# EAGLE design zamekKodowy_odbiornik (EAGLE 6.3)
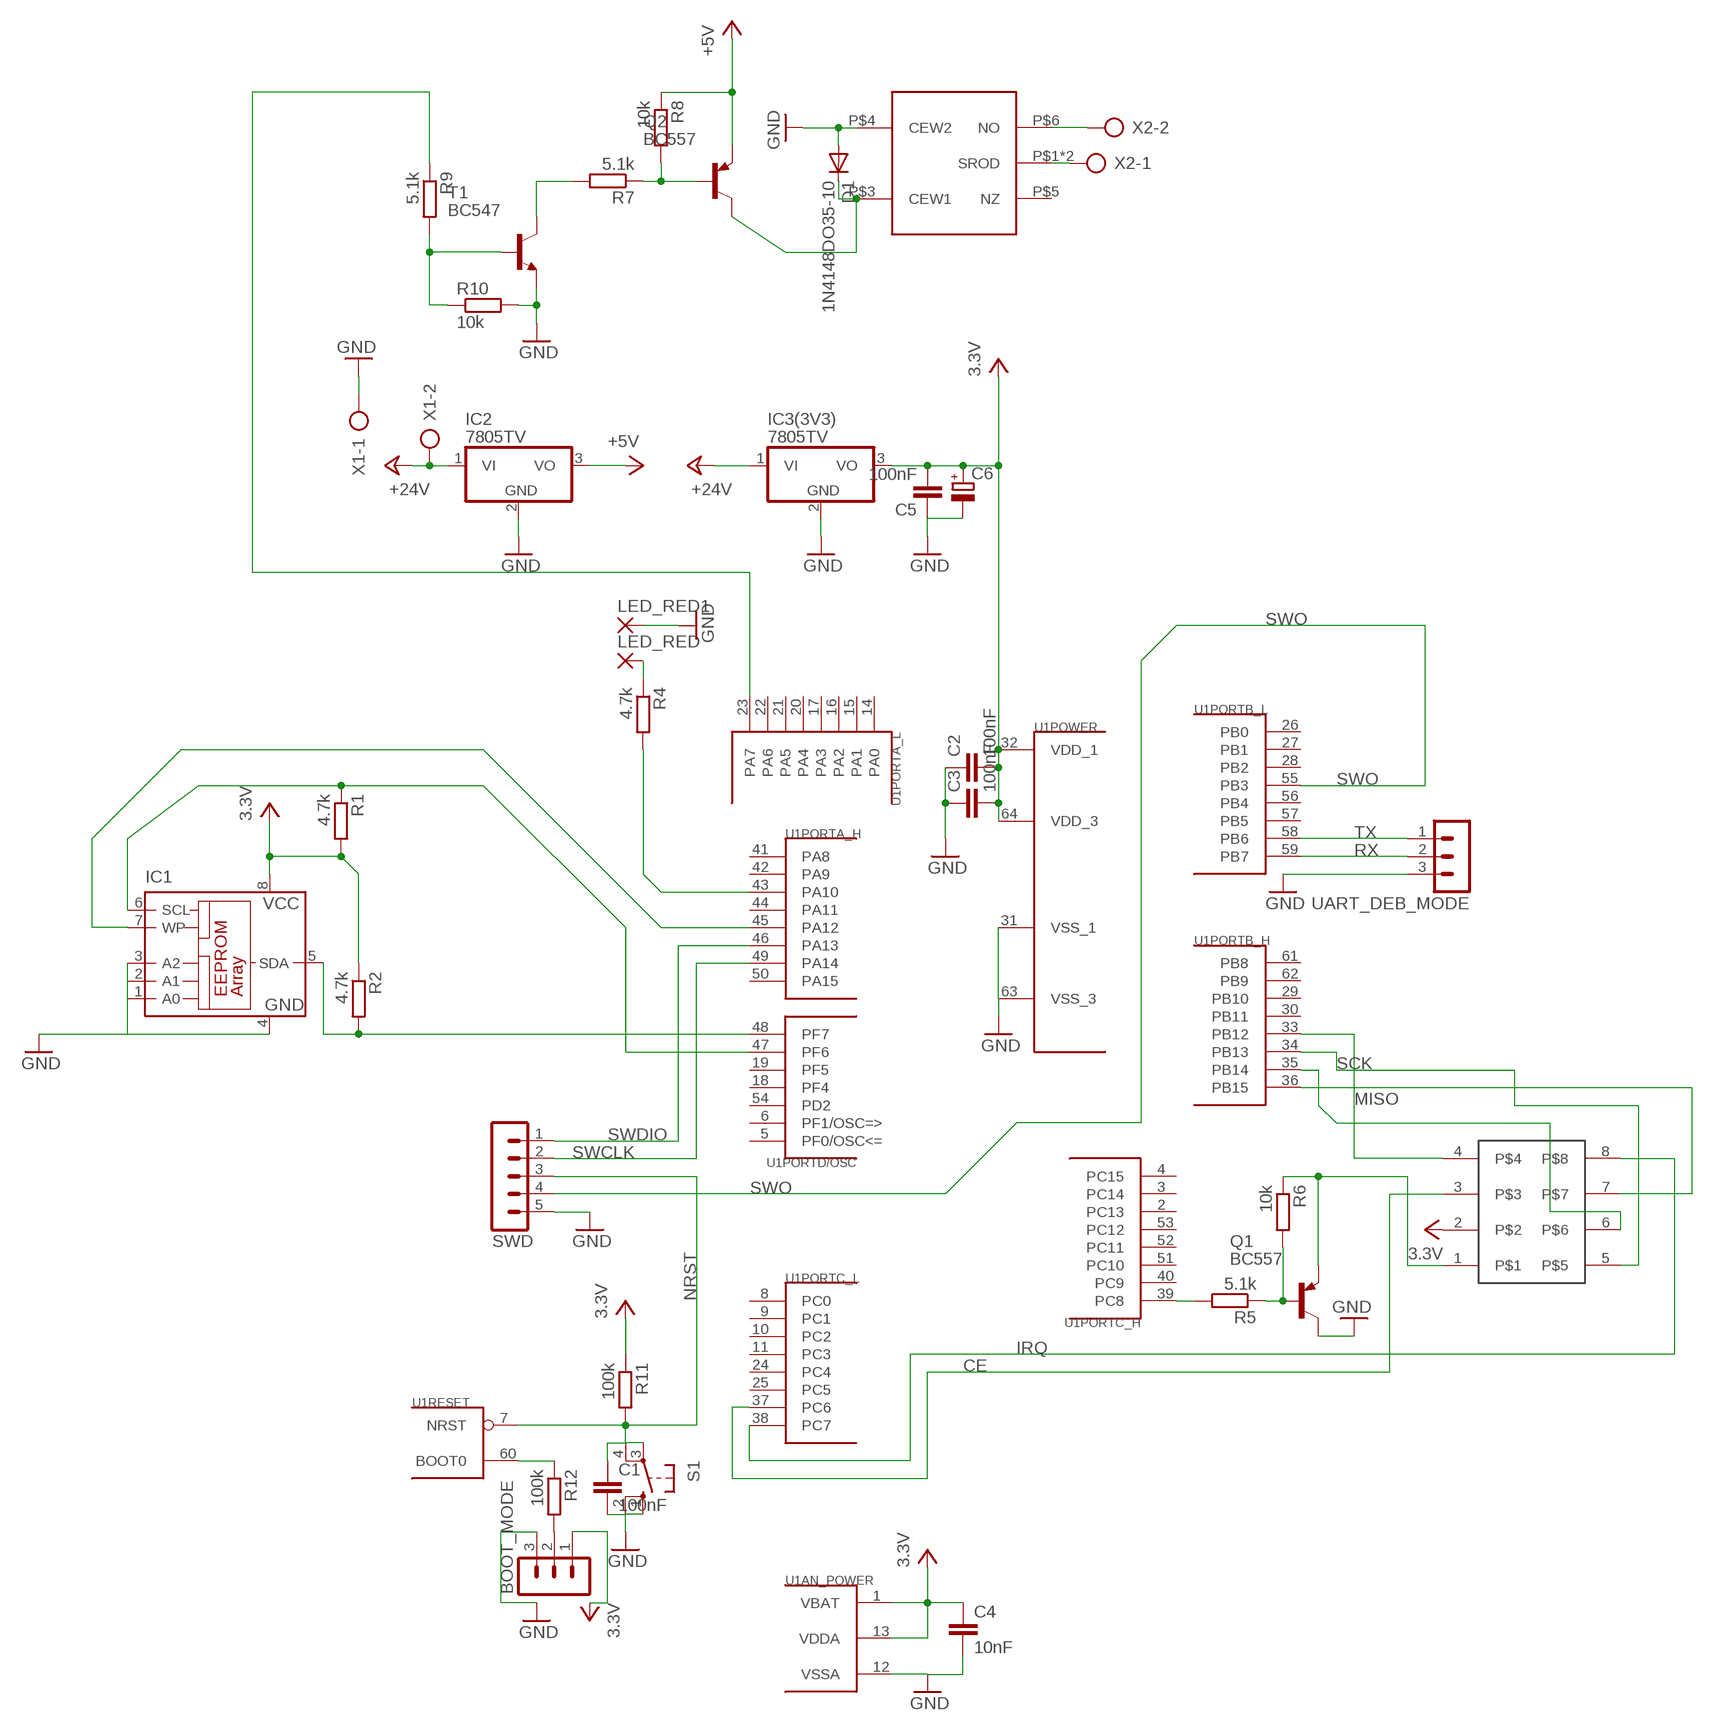
[diagram p0: schematic, sheet 1]

## Parts
BOOT_MODE  MA03-1  [MA03-1]
C1  100nF  C-EUC0603  [C0603]
C2  100nF  C-EUC0603  [C0603]
C3  100nF  C-EUC0603  [C0603]
C4  10nF  C-EUC0603  [C0603]
C5  100nF  C-EUC0603  [C0603]
C6  CPOL-EUE2-5  [E2-5]
CON1  CON10  [CON10]
D1  1N4148DO35-10  [DO35-10]
IC1  24C16BSN  [SO-08]
IC2  7805TV  [TO220V]
IC3(3V3)  7805TV  [TO220V]
LED_RED  2,54/0,9  [2,54/0,9]
LED_RED1  2,54/0,9  [2,54/0,9]
Q1  BC557  [TO92]
Q2  BC557  [TO92]
R1  4.7k  R-EU_R0603  [R0603]
R2  4.7k  R-EU_R0603  [R0603]
R4  4.7k  R-EU_R0603  [R0603]
R5  5.1k  R-EU_R0603  [R0603]
R6  10k  R-EU_R0603  [R0603]
R7  5.1k  R-EU_R0603  [R0603]
R8  10k  R-EU_R0603  [R0603]
R9  5.1k  R-EU_R0603  [R0603]
R10  10k  R-EU_R0603  [R0603]
R11  100k  R-EU_R0603  [R0603]
R12  100k  R-EU_R0603  [R0603]
S1  10-XX  [B3F-10XX]
SWD  MA05-1  [MA05-1]
T1  BC547  [TO92]
U1  STM32F10XRXT6  [TQFP64]
U$1  PRZEKAZ  [FPR]
UART_DEB_MODE  MA03-1  [MA03-1]
X1  AK300/2  [AK300/2]
X2  AK300/2  [AK300/2]

## Nets
+5V: IC2.3(VO) Q2.1(E) R8.1
+24V: IC2.1(VI) IC3(3V3).1(VI) X1.2
CE: CON1.3 U1.37(PORTC_L:PC6)
GND: BOOT_MODE.3 C1.2 C2.1 C3.1 C4.2 C5.1 C6.- D1.A IC1.1(A0) IC1.2(A1) IC1.3(A2) IC1.4(GND) IC2.2(GND) IC3(3V3).2(GND) LED_RED1.1(P) Q1.3(C) R10.2 S1.1(S) S1.2(S1) SWD.5 T1.1(E) U1.12(AN_POWER:VSSA) U1.31(POWER:VSS_1) U1.63(POWER:VSS_3) U$1.P$4(CEW2) UART_DEB_MODE.3 X1.1
IRQ: CON1.8 U1.38(PORTC_L:PC7)
MISO: CON1.7 U1.36(PORTB_H:PB15)
MOSI: CON1.6 U1.35(PORTB_H:PB14)
N$1: IC1.5(SDA) R2.2 U1.48(PORTD/OSC:PF7)
N$2: IC1.6(SCL) R1.1 U1.47(PORTD/OSC:PF6)
N$3: IC1.7(WP) U1.45(PORTA_H:PA12)
N$4: R9.1 U1.23(PORTA_L:PA7)
N$5: R4.2 U1.43(PORTA_H:PA10)
N$7: LED_RED.1(P) R4.1
N$8: Q1.2(B) R5.1 R6.2
N$9: U$1.P$1(SROD) U$1.P$2(SROD) X2.1
N$10: R5.2 U1.39(PORTC_H:PC8)
N$11: CON1.1 Q1.1(E) R6.1
N$12: U$1.P$6(NO) X2.2
N$13: D1.C Q2.3(C) U$1.P$3(CEW1)
N$14: Q2.2(B) R7.1 R8.2
N$16: R7.2 T1.3(C)
N$17: R9.2 R10.1 T1.2(B)
N$19: R12.1 U1.60(RESET:BOOT0)
N$20: BOOT_MODE.2 R12.2
NRST: C1.1 R11.2 S1.3(P) S1.4(P1) SWD.3 U1.7(RESET:NRST)
NSS: CON1.4 U1.33(PORTB_H:PB12)
RX: U1.59(PORTB_L:PB7) UART_DEB_MODE.2
SCK: CON1.5 U1.34(PORTB_H:PB13)
SWCLK: SWD.2 U1.49(PORTA_H:PA14)
SWDIO: SWD.1 U1.46(PORTA_H:PA13)
SWO: SWD.4 U1.55(PORTB_L:PB3)
TX: U1.58(PORTB_L:PB6) UART_DEB_MODE.1
VCC: BOOT_MODE.1 C2.2 C3.2 C4.1 C5.2 C6.+ CON1.2 IC1.8(VCC) IC3(3V3).3(VO) R1.2 R2.1 R11.1 U1.1(AN_POWER:VBAT) U1.13(AN_POWER:VDDA) U1.32(POWER:VDD_1) U1.64(POWER:VDD_3) ; supply symbol labelled 3.3V
Unconnected: U1.2(PORTC_H:PC13) U1.3(PORTC_H:PC14) U1.4(PORTC_H:PC15) U1.5(PORTD/OSC:PF0/OSC<=) U1.6(PORTD/OSC:PF1/OSC=>) U1.8(PORTC_L:PC0) U1.9(PORTC_L:PC1) U1.10(PORTC_L:PC2) U1.11(PORTC_L:PC3) U1.14(PORTA_L:PA0) U1.15(PORTA_L:PA1) U1.16(PORTA_L:PA2) U1.17(PORTA_L:PA3) U1.18(PORTD/OSC:PF4) U1.19(PORTD/OSC:PF5) U1.20(PORTA_L:PA4) U1.21(PORTA_L:PA5) U1.22(PORTA_L:PA6) U1.24(PORTC_L:PC4) U1.25(PORTC_L:PC5) U1.26(PORTB_L:PB0) U1.27(PORTB_L:PB1) U1.28(PORTB_L:PB2) U1.29(PORTB_H:PB10) U1.30(PORTB_H:PB11) U1.40(PORTC_H:PC9) U1.41(PORTA_H:PA8) U1.42(PORTA_H:PA9) U1.44(PORTA_H:PA11) U1.50(PORTA_H:PA15) U1.51(PORTC_H:PC10) U1.52(PORTC_H:PC11) U1.53(PORTC_H:PC12) U1.54(PORTD/OSC:PD2) U1.56(PORTB_L:PB4) U1.57(PORTB_L:PB5) U1.61(PORTB_H:PB8) U1.62(PORTB_H:PB9) U$1.P$5(NZ)

## Library data of the parts
BOOT_MODE UART_DEB_MODE = con-lstb:MA03-1: PIN HEADER; OC_FARNELL: unknown; OC_NEWARK: unknown
C1-C5 = resistor:C-EU: CAPACITOR, European symbol
C6 = resistor:CPOL-EU: POLARIZED CAPACITOR, European symbol
CON1 = con-harting:CON10: CONNECTOR; OC_FARNELL: unknown; OC_NEWARK: unknown
D1 = diode:1N4148: DIODE high speed (Philips)
IC1 = microchip:24*: Serial EEPROM I2C; MPN: AT24C16BN-SH-B; OC_FARNELL: 1362651; OC_NEWARK: 50M3324
IC2 IC3(3V3) = linear:78*: Positive VOLTAGE REGULATOR Source: http://cache.national.com/ds/LM/LM78L05.pdf http://www.fairchildsemi.com/ds/LM/LM7805.pdf
LED_RED LED_RED1 = wirepad:2,54/0,9: THROUGH-HOLE PAD
Q1 Q2 = transistor-pnp:BC557: PNP Transistor
R1 R2 R4-R12 = rcl:R-EU_: RESISTOR, European symbol
S1 = switch-omron:10-XX: OMRON SWITCH; MPN: B3F-1000; OC_FARNELL: 176432; OC_NEWARK: 36M3542
SWD = con-lstb:MA05-1: PIN HEADER; OC_FARNELL: unknown; OC_NEWARK: unknown
T1 = transistor:BC547: NPN TRANSISTOR
U1 = stm32F051R8:STM32F10XRXT6: STM32F101/103 64pin LQFP
U$1 = relay_12:PRZEKAZ
X1 X2 = con-ptr500:AK300/2: CONNECTOR; OC_FARNELL: unknown; OC_NEWARK: unknown

## Net classes
0 default: clearance 0.152 mm

## Board
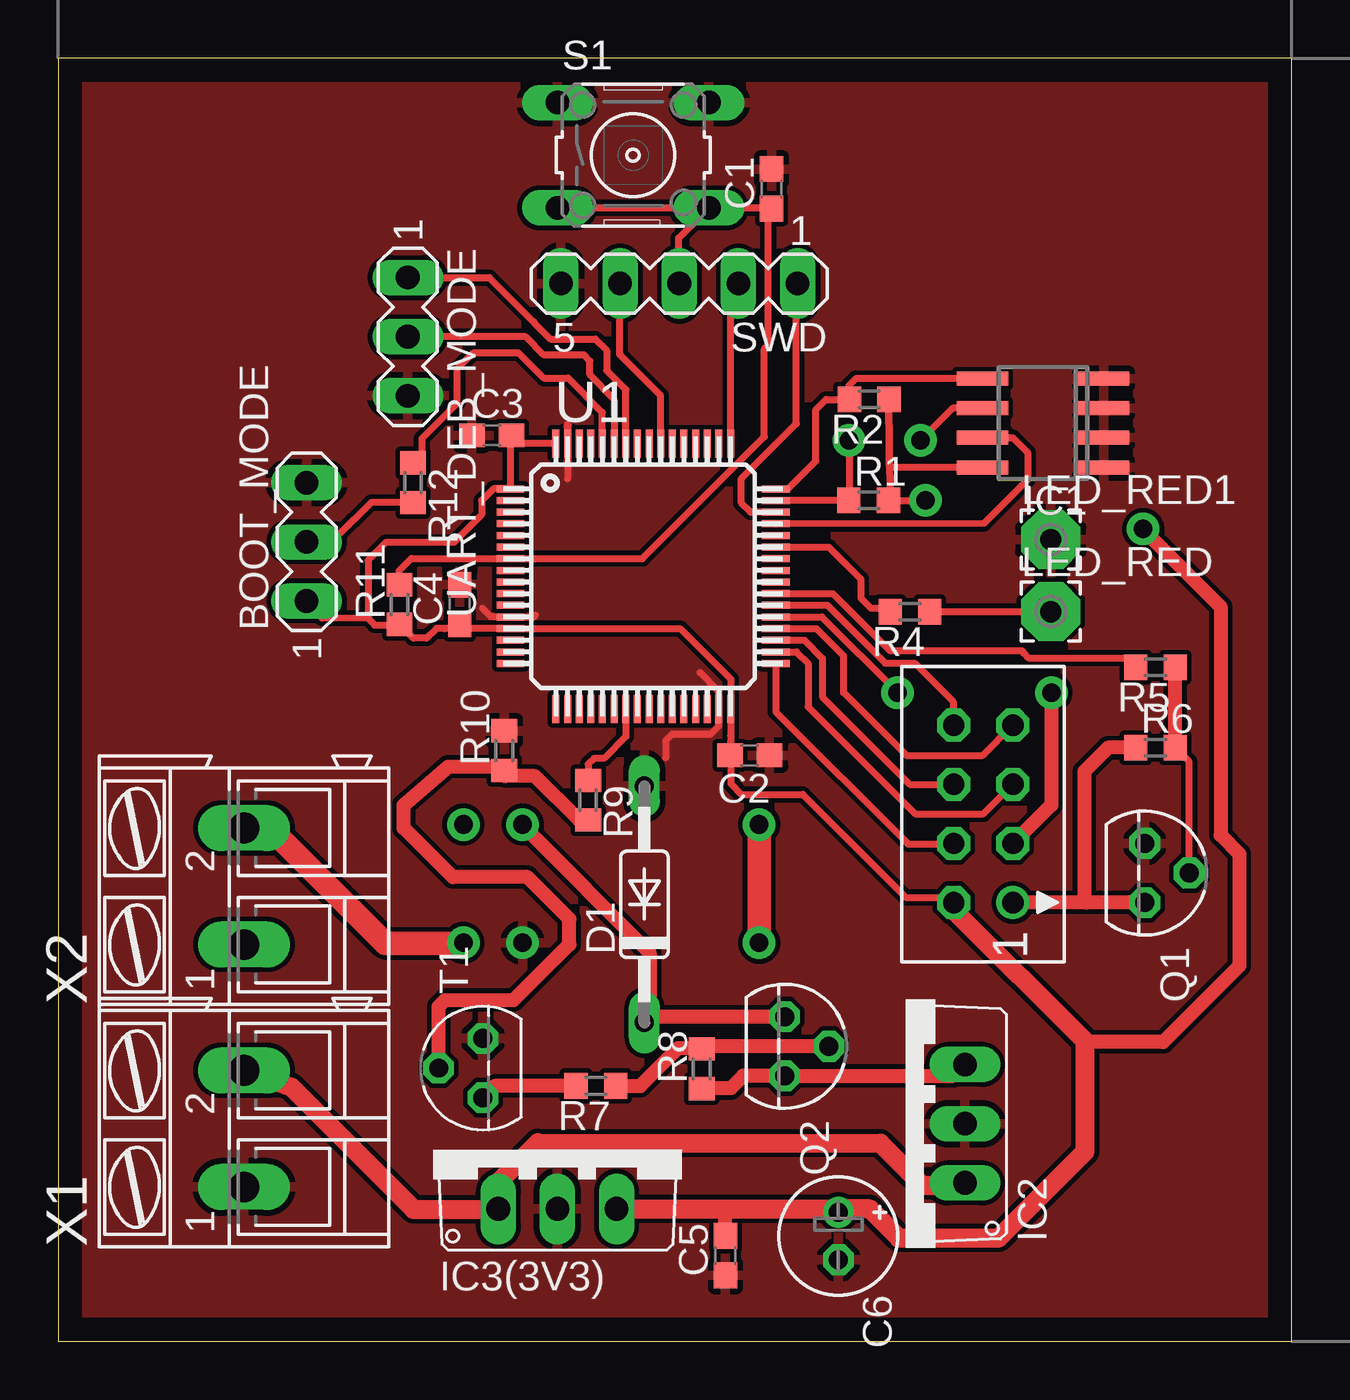
[diagram p1: board, top side]
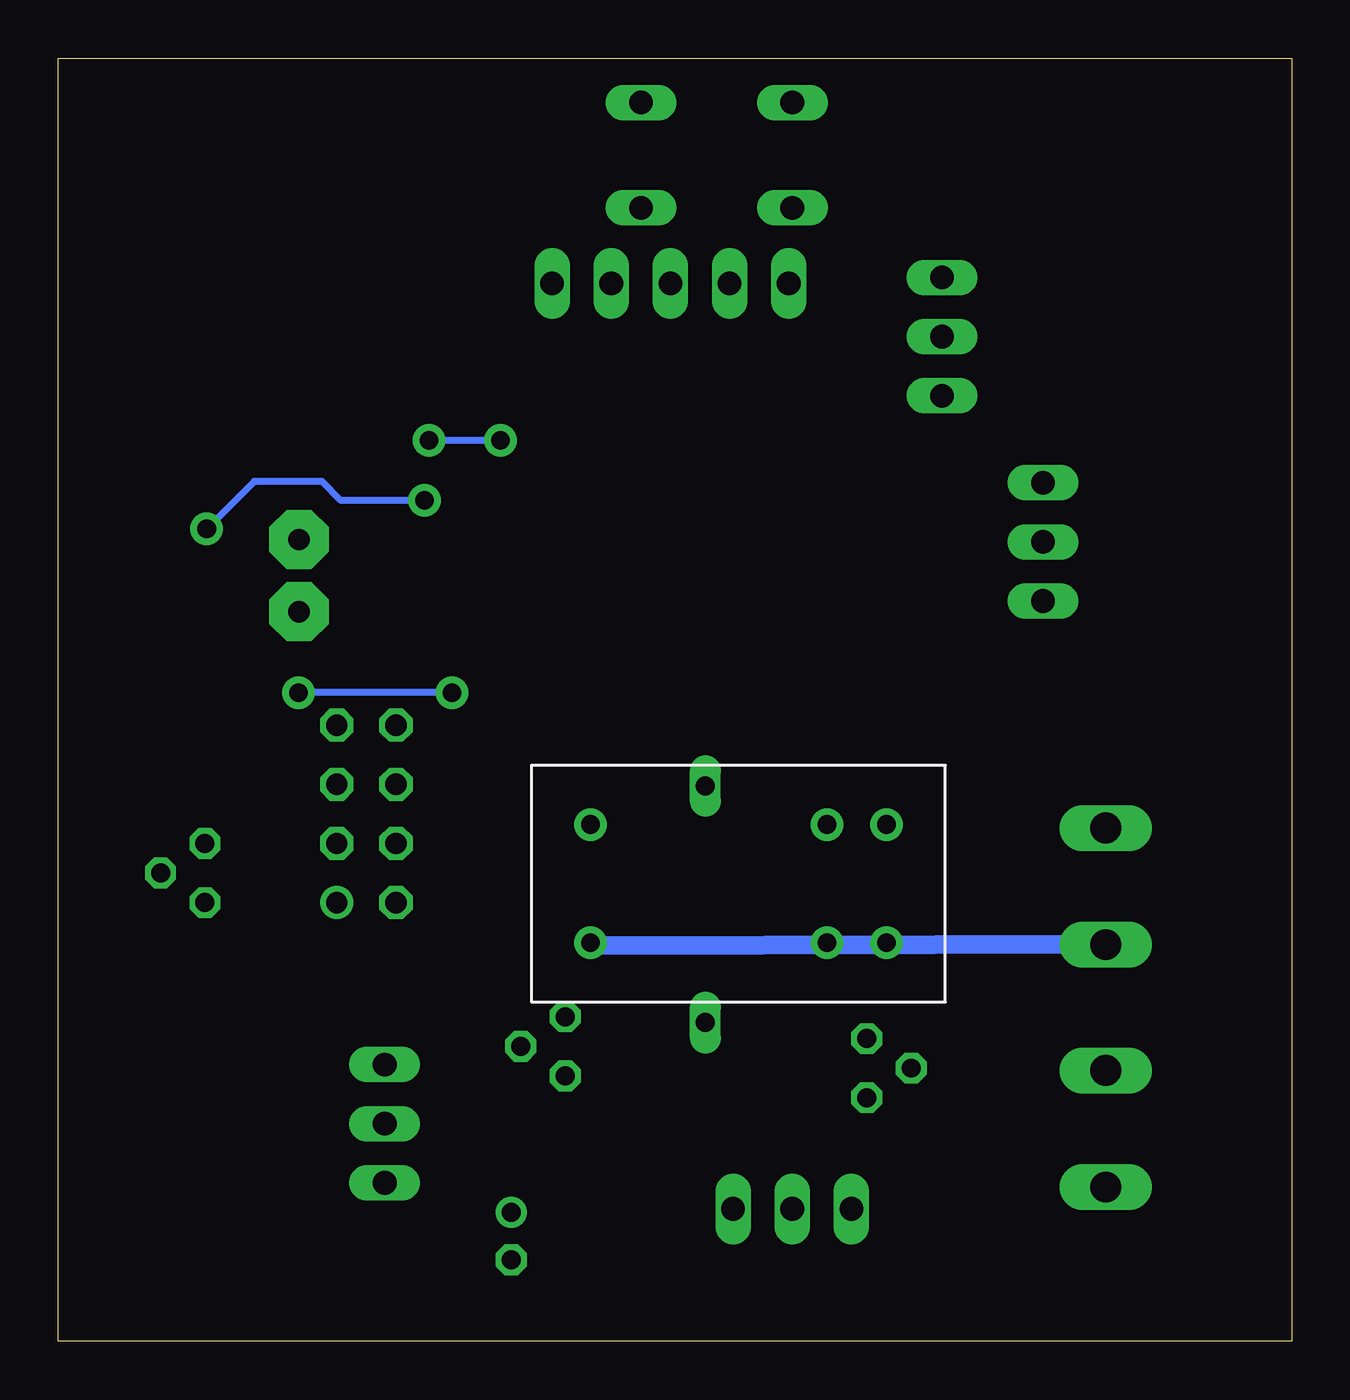
[diagram p2: board, bottom side, seen from below]

Size 52.96 x 55.12 mm. Coordinates in mm from the lower left corner, seen from the top.
Outline: 0,0 52.96,0 52.96,55.12 0,55.12 0,0
Copper layers (1*16): Top 0.035mm / dielectric 1.5mm / Bottom 0.035mm
Design rules "default": minimum track width 10mil, minimum drill 24mil, track to track 8mil, track to pad 8mil, pad to pad 8mil, via to via 8mil, smd to smd 8mil, copper to edge 40mil, drill to drill 8mil, minimum pad ring 10mil, minimum via ring 8mil, stop-mask expansion 4mil, vias tented up to drill 0mil, thermal gap 10mil

### Footprints (pad centres in the part's own frame; a part is rotated, then mirrored left to right if it is on the bottom)
MA03-1 = drill 1.016 long: 1 -2.54,0; 2 0,0; 3 2.54,0
C0603 = smd 1.1 x 1: 1 -0.85,0; 2 0.85,0
E2-5 = drill 0.813 pad 1.27: + -1.016,0 | drill 0.813 pad 1.27 octagon: - 1.016,0
CON10 = drill 0.914: 1 -5.08,-1.27 | drill 0.914 octagon: 2 -5.08,1.27; 3 -2.54,-1.27; 4 -2.54,1.27; 5 0,-1.27; 6 0,1.27; 7 2.54,-1.27; 8 2.54,1.27
DO35-10 = drill 0.813 long: A 5.08,0; C -5.08,0
SO-08 = smd 0.6 x 2.2: 1 -1.905,-2.6; 2 -0.635,-2.6; 3 0.635,-2.6; 4 1.905,-2.6; 5 1.905,2.6; 6 0.635,2.6; 7 -0.635,2.6; 8 -1.905,2.6
TO220V = drill 1.016 long: 1 -2.54,-2.54; 2 0,-2.54; 3 2.54,-2.54
2,54/0,9 = drill 0.914 pad 2.54 octagon: 1 0,0
TO92 = drill 0.813 octagon: 1 1.27,0; 2 0,1.905; 3 -1.27,0
R0603 = smd 1 x 1.1: 1 -0.85,0; 2 0.85,0
B3F-10XX = drill 1.016 long: 1 -3.251,2.261; 2 3.251,2.261; 3 -3.251,-2.261; 4 3.251,-2.261
MA05-1 = drill 1.016 long: 1 -5.08,0; 2 -2.54,0; 3 0,0; 4 2.54,0; 5 5.08,0
TQFP64 = smd 1.2 x 0.3: 1 -5.7,3.75; 2 -5.7,3.25; 3 -5.7,2.75; 4 -5.7,2.25; 5 -5.7,1.75; 6 -5.7,1.25; 7 -5.7,0.75; 8 -5.7,0.25; 9 -5.7,-0.25; 10 -5.7,-0.75; 11 -5.7,-1.25; 12 -5.7,-1.75; 13 -5.7,-2.25; 14 -5.7,-2.75; 15 -5.7,-3.25; 16 -5.7,-3.75; 33 5.7,-3.75; 34 5.7,-3.25; 35 5.7,-2.75; 36 5.7,-2.25; 37 5.7,-1.75; 38 5.7,-1.25; 39 5.7,-0.75; 40 5.7,-0.25; 41 5.7,0.25; 42 5.7,0.75; 43 5.7,1.25; 44 5.7,1.75; 45 5.7,2.25; 46 5.7,2.75; 47 5.7,3.25; 48 5.7,3.75 | smd 0.3 x 1.2: 17 -3.75,-5.7; 18 -3.25,-5.7; 19 -2.75,-5.7; 20 -2.25,-5.7; 21 -1.75,-5.7; 22 -1.25,-5.7; 23 -0.75,-5.7; 24 -0.25,-5.7; 25 0.25,-5.7; 26 0.75,-5.7; 27 1.25,-5.7; 28 1.75,-5.7; 29 2.25,-5.7; 30 2.75,-5.7; 31 3.25,-5.7; 32 3.75,-5.7; 49 3.75,5.7; 50 3.25,5.7; 51 2.75,5.7; 52 2.25,5.7; 53 1.75,5.7; 54 1.25,5.7; 55 0.75,5.7; 56 0.25,5.7; 57 -0.25,5.7; 58 -0.75,5.7; 59 -1.25,5.7; 60 -1.75,5.7; 61 -2.25,5.7; 62 -2.75,5.7; 63 -3.25,5.7; 64 -3.75,5.7
FPR = drill 0.8 pad 1.4: P$1 -2.54,-2.54; P$2 2.54,-2.54; P$3 -2.54,7.62; P$4 2.54,7.62; P$5 -2.54,10.16; P$6 2.54,10.16
AK300/2 = drill 1.321 long: 1 -2.515,0; 2 2.489,0

### Placement (x,y rotation side)
BOOT_MODE  10.67,34.34 90 top
C1  30.63,49.5 90 top
C2  29.69,25.17 180 top
C3  18.62,38.91 0 top
C4  17.25,31.65 90 top
C5  28.65,3.68 90 top
C6  33.5,4.52 270 top
CON1  39.73,23.93 90 top
D1  25.17,18.77 90 top
IC1  42.29,39.45 90 top
IC2  36.4,9.35 90 top
IC3(3V3)  21.44,8.23 0 top
LED_RED  42.62,31.34 0 top
LED_RED1  42.62,34.44 0 top
Q1  46.66,20.12 270 top
Q2  31.19,12.67 270 top
R1  34.8,36.12 0 top
R2  34.82,40.46 180 top
R4  36.58,31.34 180 top
R5  47.12,28.96 180 top
R6  47.12,25.5 0 top
R7  23.09,10.97 180 top
R8  27.64,11.71 90 top
R9  22.76,23.24 270 top
R10  19.15,25.37 90 top
R11  14.66,31.65 90 top
R12  15.24,36.88 270 top
S1  24.69,50.95 0 top
SWD  26.67,45.44 180 top
T1  18.24,11.73 90 top
U1  25.12,32.87 0 top
U$1  27.56,19.66 270 bottom
UART_DEB_MODE  15.01,43.15 270 top
X1  7.98,9.14 90 top
X2  7.98,19.56 90 top

### Tracks (layer width: path | path; a pad name or v marks a point on that pad's centre or on a via)
+5V
  Top 0.61: IC2.3 38.46,11.4 Q2.1 29.41,11.4 28.88,10.87 27.65,10.87 R8.1
+24V
  Top 0.813: X1.2 10.01,10.92 15.27,5.66 18.87,5.66 IC3(3V3).1 18.9,6.83 20.6,8.53 35.31,8.51 37.11,6.71 38.84,6.71 IC2.1
CE  (via drill 0.8 pad 1.4)
  Top 0.305: U1.37 32.79,31.12 v36.04,27.86
  Top 0.61: v42.65,27.86 42.65,23.04 CON1.3
  Bottom 0.305: v36.04,27.86 v42.65,27.86
GND
  Top 0.305: U1.63 21.87,39.39 21.87,39.4 21.87,37.06 | 18.21,31.5 18.59,31.12 U1.12 20.42,31.12 20.5,31.19 | U1.31 28.37,26.44 | 28.37,26.44 28.02,26.09 26.37,26.09 26.09,25.81 26.09,25.06 | 28.37,26.44 28.37,27.91 27.56,28.73
  pour Top: -2.24,-1.24 53.77,-0.89 53.06,8.74 53.06,57 52.81,58.27 2.36,58.57 -1.7,58.57
IRQ
  Top 0.305: U1.38 33.03,31.62 35.51,29.13 36.78,29.13 38.43,27.48 38.43,26.49 CON1.8
MISO
  Top 0.305: U1.36 32.55,30.62 33.73,29.44 33.73,27.86 36.45,25.15 39.67,25.15 CON1.7
MOSI
  Top 0.305: U1.35 32.04,30.12 32.82,29.34 32.82,27.69 36.58,23.93 CON1.6
N$1
  Top 0.305: IC1.5 34.24,41.35 33.96,41.07 33.96,40.48 R2.2 32.97,40.46 32.54,40.03 32.54,37.82 31.33,36.62 U1.48
N$2  (via drill 0.8 pad 1.4)
  Top 0.305: U1.47 R1.1 33.96,36.13 v33.96,38.71 | IC1.6 38.4,40.08 v37.03,38.71
  Bottom 0.305: v37.03,38.71 v33.96,38.71
N$3
  Top 0.305: IC1.7 41,38.81 41.63,38.18 41.63,37.01 39.75,35.13 30.83,35.1 U1.45
N$4
  Top 0.305: U1.23 24.37,25.97 23.44,25.04 23.01,25.04 22.76,24.79 R9.1
N$5
  Top 0.305: U1.43 33.09,34.12 34.47,32.74 34.47,31.93 34.9,31.5 35.57,31.5 R4.2
N$7
  Top 0.305: R4.1 LED_RED.1
N$8
  Top 0.305: Q1.2 48.56,24.9 R6.2
  Top 0.61: R6.2 R5.1
N$9
  Top 1.016: U$1.P$2 U$1.P$1
  Bottom 0.813: X2.1 29.97,16.99 U$1.P$2
N$10
  Top 0.305: U1.39 33.26,32.12 35.71,29.67 41.38,29.67 41.45,29.59 41.45,29.57 41.66,29.36 45.86,29.36 R5.2
N$11
  Top 0.305: 44.07,18.92 44.15,18.85
  Top 0.61: Q1.1 44.15,18.85 CON1.1 | R6.1 45.08,25.5 44.07,24.49 44.07,18.92
N$12
  Top 1.016: X2.2 9.14,22 14.05,17.09 17.37,17.09 U$1.P$6
N$13
  Top 0.61: Q2.3 25.43,13.94 D1.C 25.4,13.92 25.4,16.69 19.94,22.15 U$1.P$3
N$14
  Top 0.61: Q2.2 27.75,12.67 R8.2 27.6,12.6 26.62,12.6 24.99,10.97 R7.1
N$16
  Top 0.61: R7.2 18.75,10.97 T1.3
N$17
  Top 0.61: T1.2 16.33,14.38 16.61,14.66 19.56,14.66 21.95,17.04 21.95,18.14 20.14,19.94 16.94,19.94 14.83,22.05 14.83,23.04 16.74,24.69 18.78,24.69 R10.1 19.19,24.28 20.47,24.28 22.36,22.39 R9.2
N$19
  Top 0.305: U1.60 23.37,39.9 21.89,41.38 20.85,41.38 19.76,42.47 17.83,42.47 17.14,41.78 17.14,40.31 15.62,38.79 15.62,38.11 R12.1
N$20
  Top 0.305: R12.2 13.45,36.03 12.7,35.28 12.67,35.28 11.76,34.37 10.69,34.37 BOOT_MODE.2
NRST
  Top 0.305: SWD.3 26.64,47.4 S1.4 | S1.3 S1.4 | S1.4 30.6,48.69 C1.1 30.48,48.5 30.48,42.77 30.33,42.62 30.33,38.86 25.08,33.62 U1.7 19.41,33.63 15.16,33.63 14.63,33.1 14.63,32.52 R11.2
NSS
  Top 0.305: U1.33 30.82,27.04 36.5,21.36 38.43,21.36 CON1.4
RX
  Top 0.305: U1.59 23.88,38.59 23.88,40.46 22.83,41.53 22.83,42.11 22.58,42.37 20.85,42.37 20.07,43.15 UART_DEB_MODE.2
SCK
  Top 0.305: U1.34 31.7,29.62 32.21,29.11 32.21,27.25 36.8,22.66 39.73,22.66 CON1.5
SWCLK
  Top 0.305: U1.49 28.87,44.06 SWD.2
SWDIO
  Top 0.305: U1.46 29.74,35.62 29.34,36.02 29.34,37.06 31.7,39.42 31.7,44.35 SWD.1
SWO
  Top 0.305: U1.55 25.87,40.63 24.1,42.39 SWD.4
TX
  Top 0.305: U1.58 24.37,40.88 23.55,41.71 23.55,42.57 23.06,43.05 21.13,43.05 20.42,43.76 20.42,43.79 18.52,45.69 UART_DEB_MODE.1
VCC  (via drill 0.8 pad 1.4)
  Top 0.305: U1.1 | U1.1 18.7,36.63 18.19,36.12 18.19,35.51 16.99,34.32 14.07,34.32 13.31,33.55 13.31,31.04 | 17.48,30.62 U1.13 26.71,30.62 28.88,28.45 U1.32 | 17.48,30.62 16.59,30.62 16.25,30.63 15.82,30.2 15.25,30.2 R11.1 14.62,30.76 13.59,30.76 13.31,31.04 | IC1.8 35.74,37.54 35.69,37.59 35.69,38.32 R2.1 35.7,36.17 R1.2 v37.24,36.12 | U1.32 | U1.32 | v46.58,34.9 46.58,34.87 | U1.32 28.87,26.01 C2.2 | C4.1 17.29,30.8 17.48,30.62 | 13.31,31.04 11.33,31.06 BOOT_MODE.1 | U1.1 19.43,38.67 C3.2 19.53,38.57 U1.64 | U1.32 28.88,23.95 29.34,23.49 31.98,23.49 36.4,19.08 38.23,19.08 CON1.2 | 28.65,5.41 28.37,5.69
  Top 0.61: 46.58,34.87 49.91,31.55 49.91,21.74 50.72,20.93 50.72,16.13 47.45,12.85 44.12,12.85 44.09,12.88 | C5.2 28.65,5.41
  Top 0.813: IC3(3V3).3 28.37,5.69 33.65,5.69 | CON1.2 38.48,18.49 44.09,12.88 44.09,8.15 40.39,4.44 36.09,4.44 34.85,5.69 33.65,5.69 | 33.65,5.69 C6.+
  Bottom 0.305: v37.24,36.12 40.82,36.12 41.63,36.93 44.55,36.93 v46.58,34.9

### Text on the board
tDocu: Zamek Kodowy / Odbiornik / Rev. 1.0 / 01/2014